# Altium schematic sheet mcu.SchDoc
size A4; Time: 22/04/18
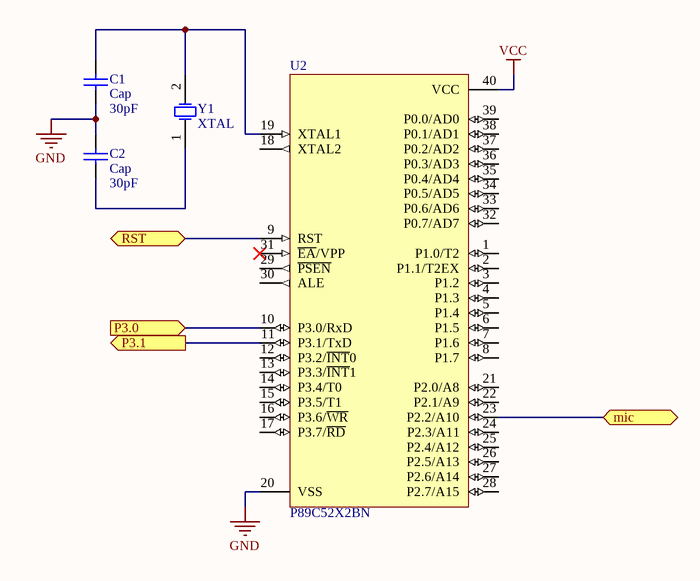
[diagram p0: mcu.SchDoc]

## Parts
C1  Cap  value 30pF  [RAD-0.3]
C2  Cap  value 30pF  [RAD-0.3]
U2  P89C52X2BN  [SOT129-1]
Y1  XTAL  [R38]

## Ports
mic (bidir), P3.0 (in), P3.1 (out), RST (bidir)

## Nets
GND: C1.1 C2.2 U2.20(VSS)
VCC: U2.40(VCC)
mic: U2.23(P2.2/A10) ; port mic
P3.0: U2.10(P3.0/RxD) ; port P3.0
P3.1: U2.11(P3.1/TxD) ; port P3.1
RST: U2.9(RST) ; port RST
NetC1_2: C1.2 U2.19(XTAL1) Y1.2(OSC2)
NetC2_1: C2.1 Y1.1(OSC1)

Not connected (* = marked no-connect by the designer): U2 1(P1.0/T2) 2(P1.1/T2EX) 3(P1.2) 4(P1.3) 5(P1.4) 6(P1.5) 7(P1.6) 8(P1.7) 12(P3.2/~{INT}0) 13(P3.3/~{INT}1) 14(P3.4/T0) 15(P3.5/T1) 16(P3.6/~{WR}) 17(P3.7/~{RD}) 18(XTAL2) 21(P2.0/A8) 22(P2.1/A9) 24(P2.3/A11) 25(P2.4/A12) 26(P2.5/A13) 27(P2.6/A14) 28(P2.7/A15) 29(~{PSEN}) 30(ALE) 31(~{EA}/VPP)* 32(P0.7/AD7) 33(P0.6/AD6) 34(P0.5/AD5) 35(P0.4/AD4) 36(P0.3/AD3) 37(P0.2/AD2) 38(P0.1/AD1) 39(P0.0/AD0)

## Notes on the sheet
- 专升本
- 通信工程
- 李烨攀
- 2101班
- 210806300163
- 学号

## Library data of the parts
C1 C2 = Cap: Capacitor; Published: 8-Jun-2000; LatestRevisionDate: 17-Jul-2002; LatestRevisionNote: Re-released for DXP Platform.; PackageReference: RAD-0.3; Publisher: Altium Limited; PackageDescription: Radial Cap, Thru-Hole; 2 Leads; 0.3 in Pin Spacing
U2 = P89C52X2BN: 80C51 8-Bit Flash Microcontroller Family, 8 kB Flash; Published: 21-May-2003; DatasheetVersion: 5-Jun-2002; PackageVersion: Aug-2000; PackageReference: SOT129-1; Publisher: Altium Limited; PackageDescription: DIP, Plastic; 40 Leads; Row Spacing 15.24 mm; Pitch 2.54 mm; Code_JEDEC: MO-015; ComponentLink1Description: Manufacturer Link; ComponentLink1URL: http://www-us2.semiconductors.philips.com/; ComponentLink2Description: Datasheet; ComponentLink2URL: http://www.semiconductors.philips.com/acrobat/datasheets/P89C5XX2_2.pdf
Y1 = XTAL: Crystal Oscillator; Published: 8-Jun-2000; LatestRevisionDate: 17-Jul-2002; LatestRevisionNote: Re-released for DXP Platform.; PackageReference: R38; Publisher: Altium Limited; PackageDescription: Crystal, Thru-Hole; 2 Leads; Body 3.1 x 8.2 mm (Dia.xH)